# Altium schematic sheet alarm_clock_devkit_main.SchDoc: Wifi Alarm Clock
size 290 x 209 mm; Author: skilbeck.com; Revision: 1; SheetNumber: 1; SheetTotal: 1
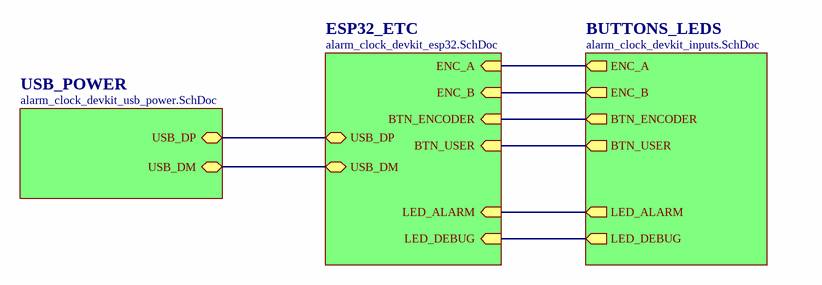
[diagram p0: alarm_clock_devkit_main.SchDoc]

## Sub-sheets
BUTTONS_LEDS = alarm_clock_devkit_inputs.SchDoc: BTN_USER (out), ENC_A (out), ENC_B (out), BTN_ENCODER (out), LED_DEBUG (out), LED_ALARM (out)
ESP32_ETC = alarm_clock_devkit_esp32.SchDoc: LED_DEBUG (in), BTN_ENCODER (in), BTN_USER (in), ENC_B (in), ENC_A (in), LED_ALARM (in), USB_DM (bidir), USB_DP (bidir)
USB_POWER = alarm_clock_devkit_usb_power.SchDoc: USB_DP (bidir), USB_DM (bidir)

## Nets
(unnamed): sheet BUTTONS_LEDS/BTN_USER, sheet ESP32_ETC/BTN_USER
(unnamed): sheet BUTTONS_LEDS/ENC_A, sheet ESP32_ETC/ENC_A
(unnamed): sheet BUTTONS_LEDS/ENC_B, sheet ESP32_ETC/ENC_B
(unnamed): sheet BUTTONS_LEDS/BTN_ENCODER, sheet ESP32_ETC/BTN_ENCODER
(unnamed): sheet BUTTONS_LEDS/LED_DEBUG, sheet ESP32_ETC/LED_DEBUG
(unnamed): sheet BUTTONS_LEDS/LED_ALARM, sheet ESP32_ETC/LED_ALARM
(unnamed): sheet USB_POWER/USB_DP, sheet ESP32_ETC/USB_DP
(unnamed): sheet USB_POWER/USB_DM, sheet ESP32_ETC/USB_DM